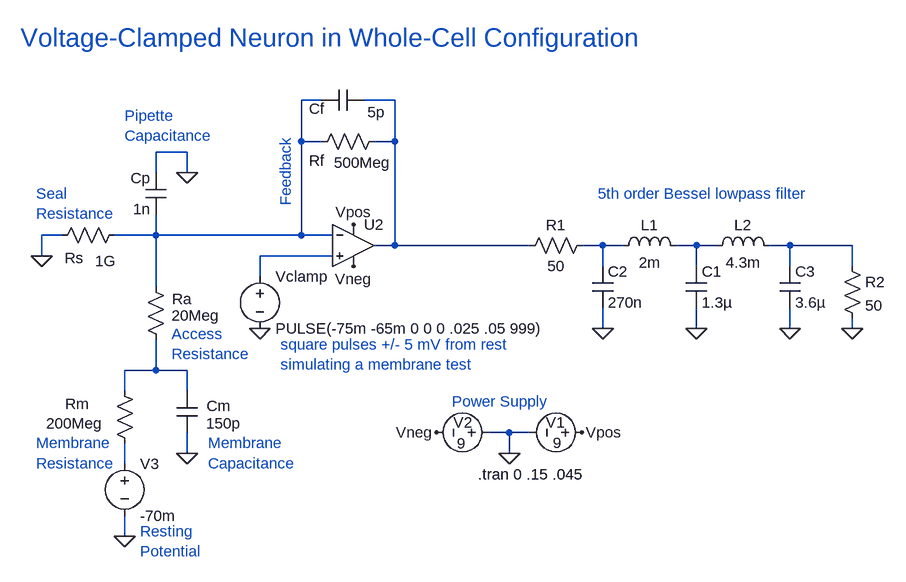
[diagram p0: schematic voltage-clamp.asc]
voltage-clamp.asc, the LTspice schematic file:
Version 4
SHEET 1 1292 692
WIRE 400 -16 368 -16
WIRE 512 -16 464 -16
WIRE 368 48 368 -16
WIRE 400 48 368 48
WIRE 512 48 512 -16
WIRE 512 48 480 48
WIRE 192 64 144 64
WIRE 144 96 144 64
WIRE 192 96 192 64
WIRE 0 192 -32 192
WIRE 144 192 144 160
WIRE 144 192 80 192
WIRE 368 192 368 48
WIRE 368 192 144 192
WIRE 416 192 368 192
WIRE 512 208 512 48
WIRE 512 208 480 208
WIRE 720 208 512 208
WIRE 832 208 800 208
WIRE 864 208 832 208
WIRE 976 208 944 208
WIRE 1008 208 976 208
WIRE 1120 208 1088 208
WIRE 1216 208 1120 208
WIRE -32 224 -32 192
WIRE 416 224 304 224
WIRE 832 240 832 208
WIRE 976 240 976 208
WIRE 1120 240 1120 208
WIRE 1216 240 1216 208
WIRE 304 256 304 224
WIRE 144 272 144 192
WIRE 832 336 832 304
WIRE 976 336 976 304
WIRE 1120 336 1120 304
WIRE 1216 336 1216 320
WIRE 144 400 144 352
WIRE 144 400 96 400
WIRE 192 400 144 400
WIRE 96 432 96 400
WIRE 192 432 192 400
WIRE 688 496 656 496
WIRE 720 496 688 496
WIRE 192 528 192 496
WIRE 688 528 688 496
WIRE 96 544 96 512
WIRE 96 656 96 624
FLAG 800 496 Vpos
FLAG 448 176 Vpos
FLAG 448 240 Vneg
FLAG 576 496 Vneg
FLAG 304 336 0
FLAG 192 528 0
FLAG 192 96 0
FLAG 688 528 0
FLAG -32 224 0
FLAG 976 336 0
FLAG 832 336 0
FLAG 1120 336 0
FLAG 1216 336 0
FLAG 96 656 0
SYMBOL res 496 32 R90
WINDOW 0 61 104 VBottom 2
WINDOW 3 33 34 VTop 2
SYMATTR InstName Rf
SYMATTR Value 500Meg
SYMBOL voltage 816 496 R90
WINDOW 0 -16 42 VRight 2
WINDOW 3 16 47 VRight 2
WINDOW 123 0 0 Left 0
WINDOW 39 0 0 Left 0
SYMATTR InstName V1
SYMATTR Value 9
SYMBOL OpAmps\\UniversalOpamp2 448 208 R0
SYMATTR InstName U2
SYMBOL voltage 672 496 R90
WINDOW 0 -16 41 VRight 2
WINDOW 3 17 51 VRight 2
WINDOW 123 0 0 Left 0
WINDOW 39 0 0 Left 0
SYMATTR InstName V2
SYMATTR Value 9
SYMBOL voltage 304 240 R0
WINDOW 123 0 0 Left 0
WINDOW 39 0 0 Left 0
SYMATTR InstName Vclamp
SYMATTR Value PULSE(-75m -65m 0 0 0 .025 .05 999)
SYMBOL res 128 256 R0
WINDOW 0 41 34 Left 2
WINDOW 3 40 60 Left 2
SYMATTR InstName Ra
SYMATTR Value 20Meg
SYMBOL cap 176 432 R0
WINDOW 0 46 23 Left 2
WINDOW 3 45 50 Left 2
SYMATTR InstName Cm
SYMATTR Value 150p
SYMBOL res 80 416 R0
WINDOW 0 -76 36 Left 2
WINDOW 3 -105 66 Left 2
SYMATTR InstName Rm
SYMATTR Value 200Meg
SYMBOL cap 160 160 R180
WINDOW 0 24 56 Left 2
WINDOW 3 24 8 Left 2
SYMATTR InstName Cp
SYMATTR Value 1n
SYMBOL res 816 192 R90
WINDOW 0 0 56 VBottom 2
WINDOW 3 32 56 VTop 2
SYMATTR InstName R1
SYMATTR Value 50
SYMBOL res -16 208 R270
WINDOW 0 -35 34 VTop 2
WINDOW 3 -8 83 VBottom 2
SYMATTR InstName Rs
SYMATTR Value 1G
SYMBOL cap 464 -32 R90
WINDOW 0 45 72 VBottom 2
WINDOW 3 19 -19 VTop 2
SYMATTR InstName Cf
SYMATTR Value 5p
SYMBOL ind 848 224 R270
WINDOW 0 32 56 VTop 2
WINDOW 3 5 56 VBottom 2
SYMATTR InstName L1
SYMATTR Value 2m
SYMBOL cap 960 240 R0
SYMATTR InstName C1
SYMATTR Value 1.3µ
SYMBOL ind 992 224 R270
WINDOW 0 32 56 VTop 2
WINDOW 3 5 56 VBottom 2
SYMATTR InstName L2
SYMATTR Value 4.3m
SYMBOL cap 816 240 R0
SYMATTR InstName C2
SYMATTR Value 270n
SYMBOL cap 1104 240 R0
SYMATTR InstName C3
SYMATTR Value 3.6µ
SYMBOL res 1200 224 R0
SYMATTR InstName R2
SYMATTR Value 50
SYMBOL voltage 96 528 R0
WINDOW 123 0 0 Left 0
WINDOW 39 0 0 Left 0
SYMATTR InstName V3
SYMATTR Value -70m
TEXT 336 360 Left 2 ;square pulses +/- 5 mV from rest\nsimulating a membrane test
TEXT 96 8 Left 2 ;Pipette\nCapacitance
TEXT 168 344 Left 2 ;Access\nResistance
TEXT -40 512 Left 2 ;Membrane\nResistance
TEXT 224 512 Left 2 ;Membrane\nCapacitance
TEXT 600 448 Left 2 ;Power Supply
TEXT 344 40 VRight 2 ;Feedback
TEXT -64 -112 Left 4 ;Voltage-Clamped Neuron in Whole-Cell Configuration
TEXT 640 560 Left 2 !.tran 0 .15 .045
TEXT -40 128 Left 2 ;Seal\nResistance
TEXT 824 128 Left 2 ;5th order Bessel lowpass filter
TEXT 120 648 Left 2 ;Resting\nPotential

The netlist it stands for:
* voltage-clamp.asc
Rf N002 N001 500Meg
V1 Vpos 0 9
XU2 N006 N001 Vpos Vneg N002 level.2 Avol=1Meg GBW=10Meg Slew=10Meg ilimit=25m rail=0 Vos=0 phimargin=45 en=0 enk=0 in=0 ink=0 Rin=500Meg  ; pins IN+ IN- V+ V- OUT
V2 0 Vneg 9
Vclamp N006 0 PULSE(-75m -65m 0 0 0 .025 .05 999)
Ra N001 N007 20Meg
Cm N007 0 150p
Rm N007 N008 200Meg
Cp N001 0 1n
R1 N003 N002 50
Rs 0 N001 1G
Cf N002 N001 5p
L1 N003 N004 2m
C1 N004 0 1.3µ
L2 N004 N005 4.3m
C2 N003 0 270n
C3 N005 0 3.6µ
R2 N005 0 50
V3 N008 0 -70m
* square pulses +/- 5 mV from rest
* simulating a membrane test
* Pipette
* Capacitance
* Access
* Resistance
* Membrane
* Resistance
* Membrane
* Capacitance
* Power Supply
* Feedback
* Voltage-Clamped Neuron in Whole-Cell Configuration
.tran 0 .15 .045
* Seal
* Resistance
* 5th order Bessel lowpass filter
* Resting
* Potential
.lib UniversalOpamps2.sub
.backanno
.end